# EAGLE design floyd (EAGLE 7.5.0)
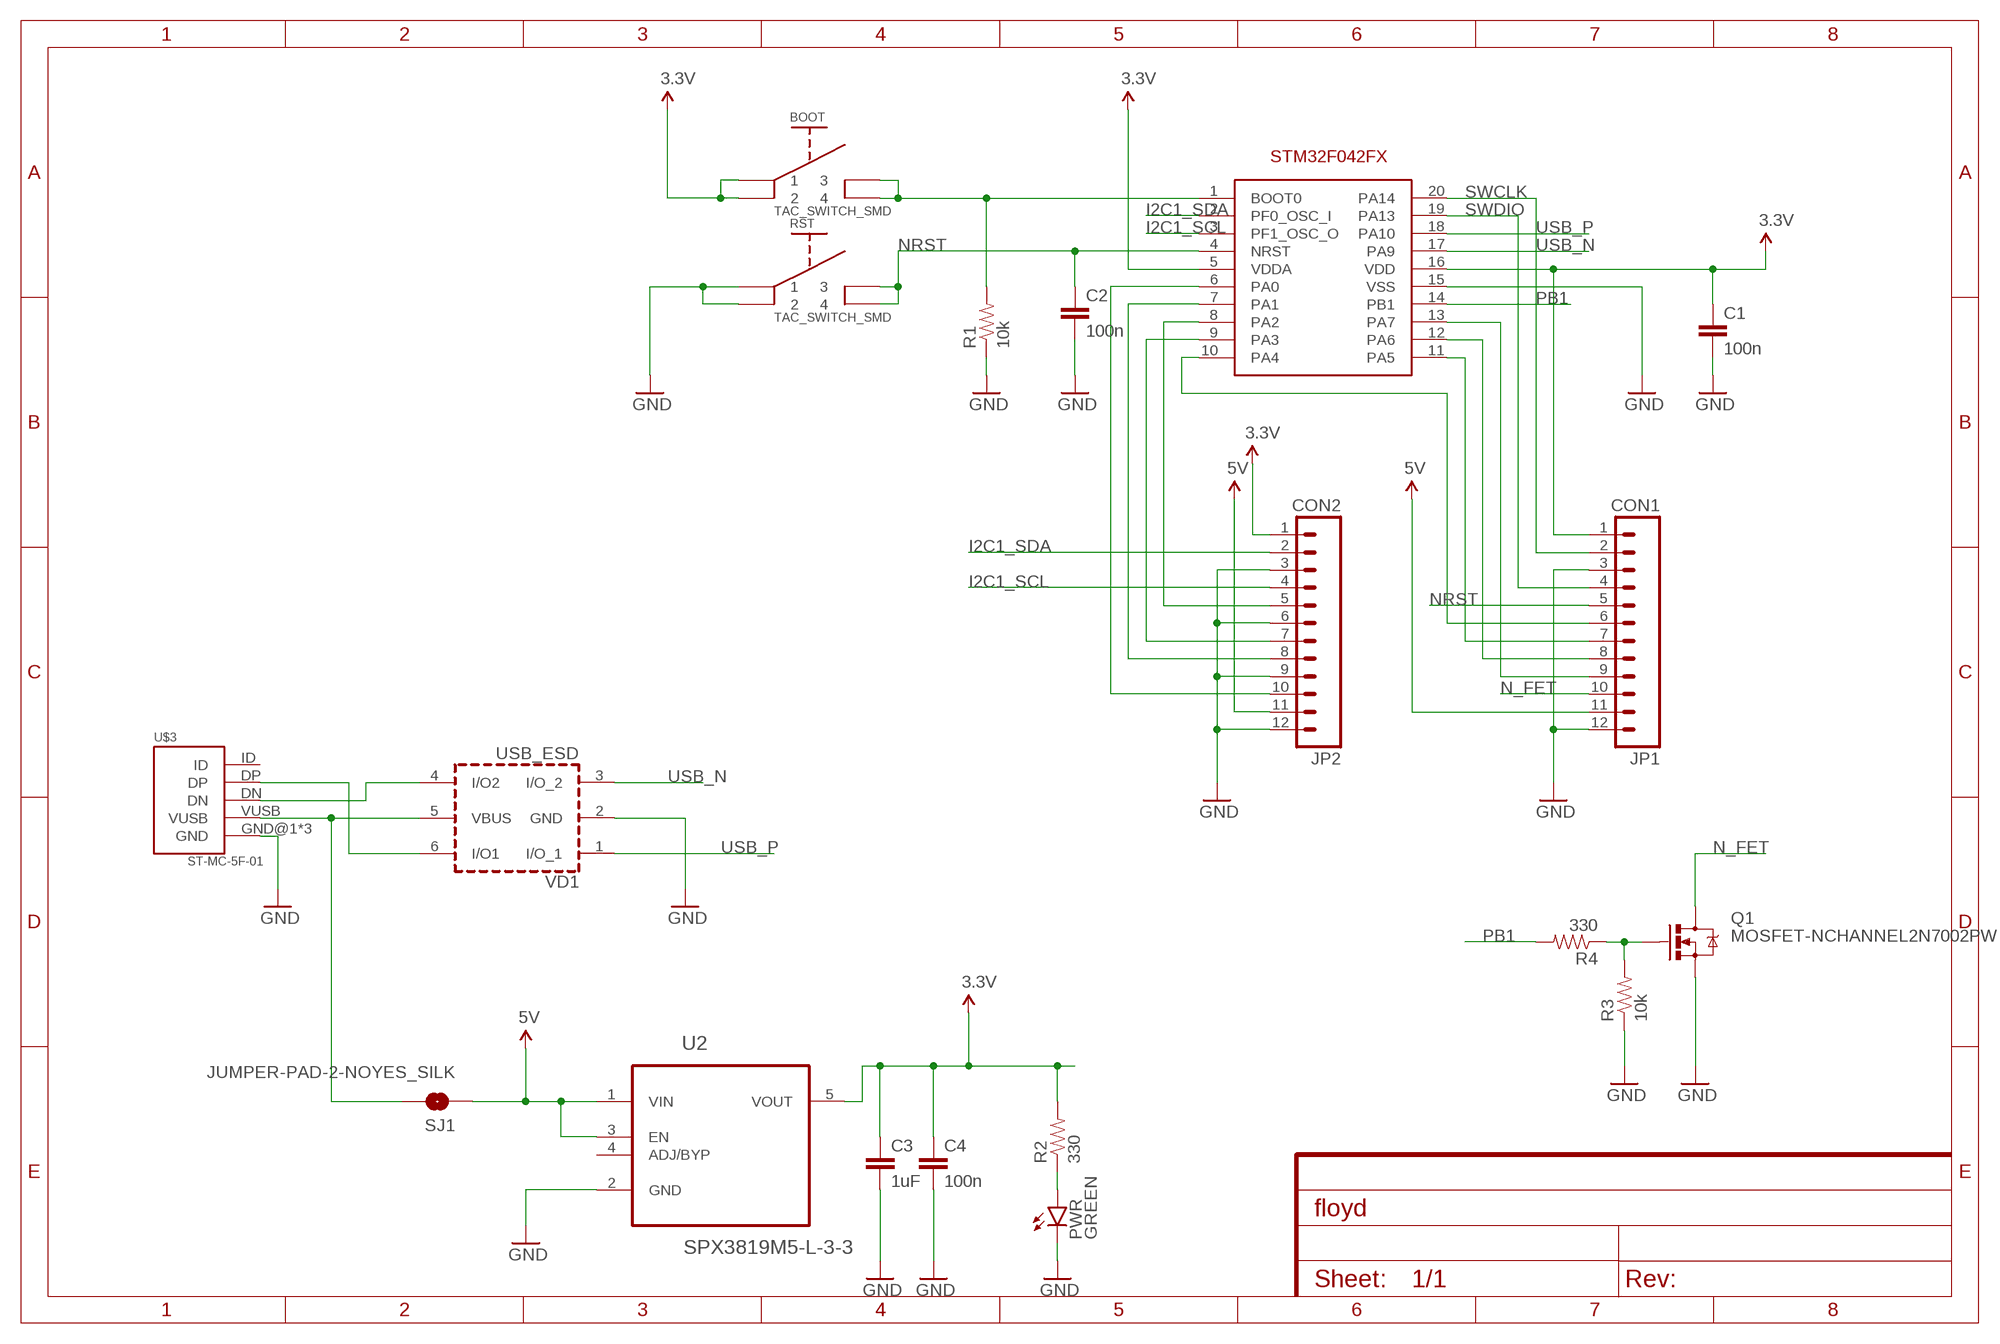
[diagram p0: schematic, sheet 1]

## Parts
BOOT  TS-017A  [TS-017ASMD]
C1  100n  CAP0603-CAP  [0603-CAP]
C2  100n  CAP0603-CAP  [0603-CAP]
C3  1uF  CAP0603-CAP  [0603-CAP]
C4  100n  CAP0603-CAP  [0603-CAP]
JP1  CON1  M12LOCK_LONGPADS  [1X12_LOCK_LONGPADS]
JP2  CON2  M12LOCK_LONGPADS  [1X12_LOCK_LONGPADS]
PWR  GREEN  LED0603  [LED-0603]
Q1  MOSFET-NCHANNEL2N7002PW  [SOT323]
R1  10k  RESISTOR0603-RES  [0603-RES]
R2  330  RESISTOR0603-RES  [0603-RES]
R3  10k  RESISTOR0603-RES  [0603-RES]
R4  330  RESISTOR0603-RES  [0603-RES]
RST  TS-017A  [TS-017ASMD]
SJ1  JUMPER-PAD-2-NOYES_SILK  [PAD-JUMPER-2-NO_YES_SILK]
U1  STM32F042FX  [TSSOP20]
U2  SPX3819M5-L-3-3  [SOT95P280X145-5N]
U$3  ST-MC-5F-01  [ST-MC-5F-01]
VD1  USB_ESD  USBLC6-2SC6  [SOT-23-6L]

## Nets
3.3V: BOOT.P$1 BOOT.P$2 C1.1 C3.1 C4.1 JP1.1 JP2.1 R2.2 U1.5(VDDA) U1.16(VDD) U2.5(VOUT)
5V: JP1.11 JP2.11 SJ1.1 U2.1(VIN) U2.3(EN)
GND: C1.2 C2.2 C3.2 C4.2 JP1.3 JP1.12 JP2.3 JP2.6 JP2.9 JP2.12 PWR.C Q1.2(S) R1.1 R3.1 RST.P$1 RST.P$2 U1.15(VSS) U2.2(GND) U$3.GND@1(GND) U$3.GND@2(GND) U$3.GND@3(GND) VD1.2(GND)
I2C1_SCL: JP2.4 U1.3(PF1_OSC_O)
I2C1_SDA: JP2.2 U1.2(PF0_OSC_I)
N$1: BOOT.P$3 BOOT.P$4 R1.2 U1.1(BOOT0)
N$2: SJ1.2 U$3.VUSB VD1.5(VBUS)
N$3: U$3.DN VD1.4(I/O2)
N$4: U$3.DP VD1.6(I/O1)
N$5: JP1.6 U1.10(PA4)
N$6: JP1.7 U1.11(PA5)
N$7: PWR.A R2.1
N$8: JP1.8 U1.12(PA6)
N$9: JP1.9 U1.13(PA7)
N$10: Q1.1(G) R3.2 R4.1
N$11: JP2.5 U1.8(PA2)
N$12: JP2.7 U1.9(PA3)
N$13: JP2.8 U1.7(PA1)
N$14: JP2.10 U1.6(PA0)
N_FET: JP1.10 Q1.3(D)
NRST: C2.1 JP1.5 RST.P$3 RST.P$4 U1.4(NRST)
PB1: R4.2 U1.14(PB1)
SWCLK: JP1.2 U1.20(PA14)
SWDIO: JP1.4 U1.19(PA13)
USB_N: U1.17(PA9) VD1.3(I/O_2)
USB_P: U1.18(PA10) VD1.1(I/O_1)
Unconnected: U2.4(ADJ/BYP) U$3.ID

## Library data of the parts
BOOT RST = aliexpress-ts-017a:TS-017A
C1-C4 = SparkFun-Passives:CAP: Capacitor Standard 0603 ceramic capacitor, and 0.1" leaded capacitor.
JP1 JP2 = SparkFun-Connectors:M12: Header 12 Standard 12-pin 0.1" header. Use with straight break away headers (SKU : PRT-00116), right angle break away headers (PRT-00553), swiss pins (PRT-00743), machine pins (PRT-00117), and female headers (PRT-00115).
PWR = SparkFun-LED:LED: LEDs Standard schematic elements and footprints for 5mm, 3mm, 1206, and 0603 sized LEDs. 5mm - Spark Fun Electronics SKU : COM-00529 (and others)
Q1 = SparkFun-DiscreteSemi:MOSFET-NCHANNEL: Common NMOSFET Parts MFG P/N Store ID Prod ID FDD8780 TRANS-09984 SI7820DN TRANS-11055 FDS6630A IC-08089 2N7002PW TRANS-11151 FQP30N06L COM-10213 TRANS-10060 BSS123LT1G TRANS-08345 BSS138 TRANS-00830 BS170 2N7000; PROD_ID: TRANS-11151
R1-R4 = SparkFun-Passives:RESISTOR: Resistor Basic schematic elements and footprints for 0603, 1206, and PTH resistors.
SJ1 = SparkFun-Passives:JUMPER-PAD-2-NO
U1 = STM32F042Fx:STM32F042FX: STM32F042Fx microcontroller
U2 = spx319m5-3-3:SPX3819M5-L-3-3: 500mA, LOW-NOISE LDO VOLTAGE REGULATOR; MPN: SPX3819M5-L-3-3; OC_FARNELL: 1831949; OC_NEWARK: 23R9702; PACKAGE: SOT-23-5; SUPPLIER: EXAR
U$3 = st-mc-5f-01:ST-MC-5F-01
VD1 = usblc6:USBLC6-2: VERY LOW CAPACITANCE ESD PROTECTION 2 line Datasheet link <http://www.st.com/web/catalog/sense_power/FM114/CL1137/SC1489/PF93353>

## Board
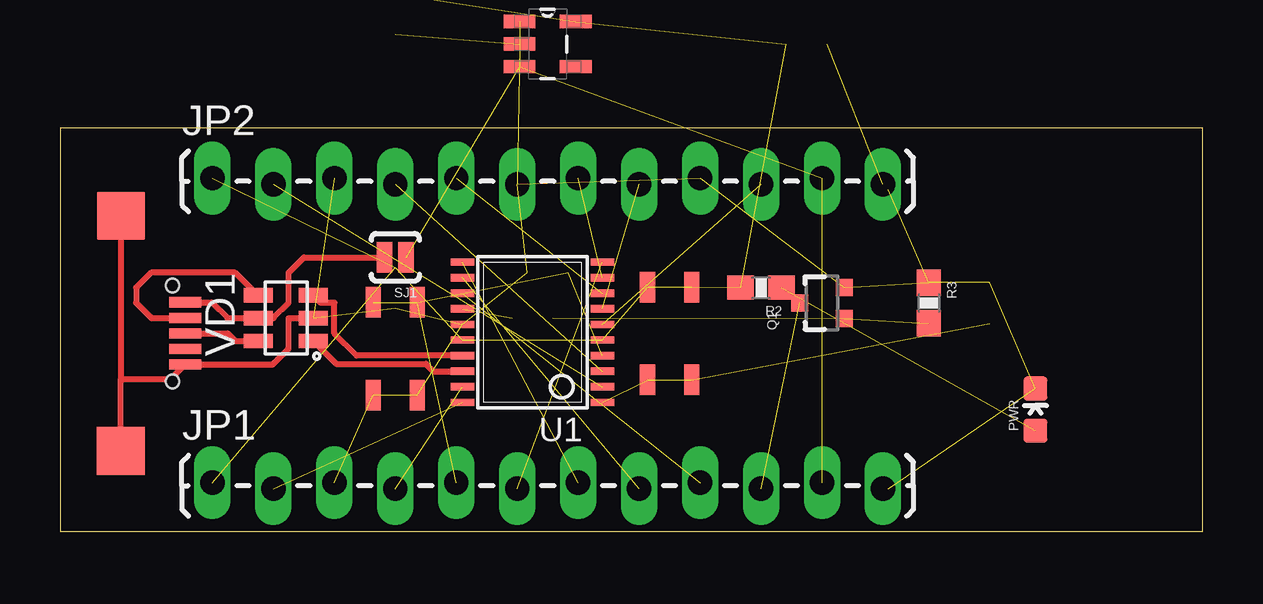
[diagram p1: board, top side]
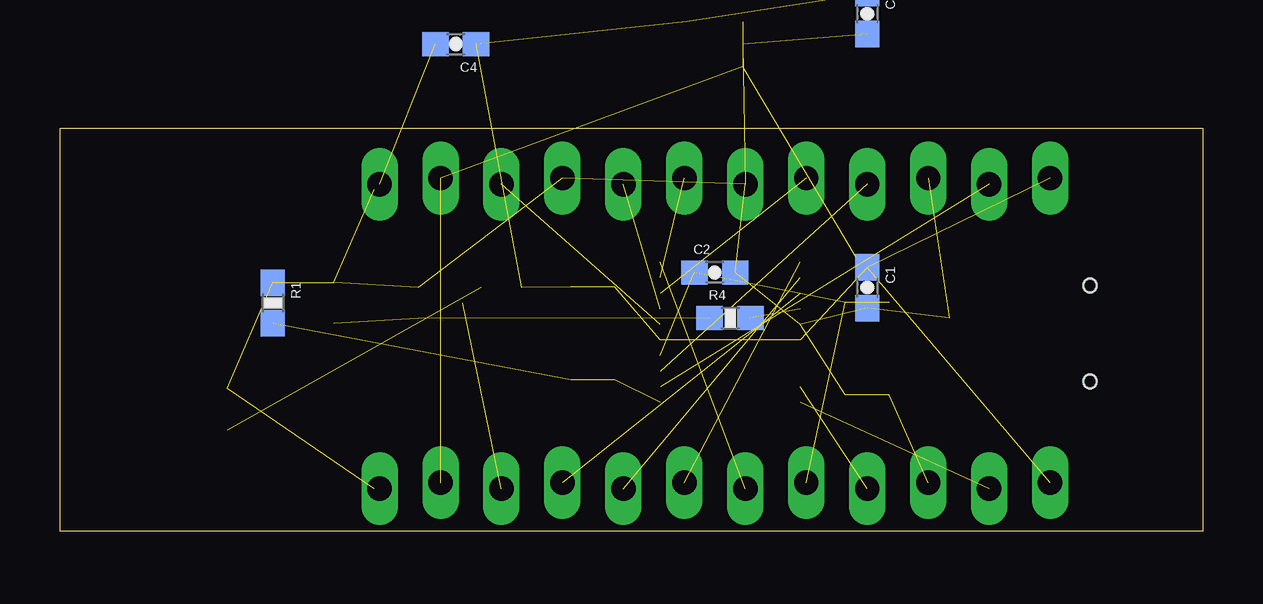
[diagram p2: board, bottom side, seen from below]

Size 47.6 x 16.82 mm. Coordinates in mm from the lower left corner, seen from the top.
Outline: 0,0 47.6,0 47.6,16.82 0,16.82 0,0
Copper layers (1*16): Top 0.035mm / dielectric 1.5mm / Bottom 0.035mm
Design rules "default": minimum track width 10mil, minimum drill 24mil, track to track 8mil, track to pad 8mil, pad to pad 8mil, via to via 8mil, smd to smd 8mil, copper to edge 40mil, drill to drill 8mil, minimum pad ring 10mil, minimum via ring 8mil, stop-mask expansion 4mil, vias tented up to drill 0mil, thermal gap 10mil

### Footprints (pad centres in the part's own frame; a part is rotated, then mirrored left to right if it is on the bottom)
TS-017ASMD = smd 1.27 x 0.635: P$1 -1.935,0.917; P$2 -1.935,-0.917; P$3 1.935,0.917; P$4 1.935,-0.917
0603-CAP = smd 1.1 x 1: 1 -0.85,0; 2 0.85,0
1X12_LOCK_LONGPADS = drill 1.016 long: 1 0,0.127; 2 2.54,-0.127; 3 5.08,0.127; 4 7.62,-0.127; 5 10.16,0.127; 6 12.7,-0.127; 7 15.24,0.127; 8 17.78,-0.127; 9 20.32,0.127; 10 22.86,-0.127; 11 25.4,0.127; 12 27.94,-0.127
LED-0603 = smd 1 x 1: A 0,-0.877; C 0,0.877
SOT323 = smd 0.7 x 0.7: 1 -0.65,-0.925; 2 0.65,-0.925; 3 0,0.925
0603-RES = smd 1.1 x 1: 1 -0.85,0; 2 0.85,0
PAD-JUMPER-2-NO_YES_SILK = smd 0.635 x 1.27: 1 -0.45,0; 2 0.45,0
TSSOP20 = smd 0.305 x 0.991: 1 -2.925,-2.918; 2 -2.275,-2.918; 3 -1.625,-2.918; 4 -0.975,-2.918; 5 -0.325,-2.918; 6 0.325,-2.918; 7 0.975,-2.918; 8 1.625,-2.918; 9 2.275,-2.918; 10 2.925,-2.918; 11 2.925,2.918; 12 2.275,2.918; 13 1.625,2.918; 14 0.975,2.918; 15 0.325,2.918; 16 -0.325,2.918; 17 -0.975,2.918; 18 -1.625,2.918; 19 -2.275,2.918; 20 -2.925,2.918
SOT95P280X145-5N = smd 1.321 x 0.559: 1 -1.168,0.94; 2 -1.168,0; 3 -1.168,-0.94; 4 1.168,-0.94; 5 1.168,0.94
ST-MC-5F-01 = smd 0.4 x 1.35: DN -0.65,2.675; DP 0,2.675; GND@3 1.3,2.675; ID 0.65,2.675; VUSB -1.3,2.675 | smd 2 x 2: GND@1 -4.9,0; GND@2 4.9,0 | hole 0.55: -2,2.15; 2,2.15
SOT-23-6L = smd 0.6 x 1.2: 1 -0.95,-2.3; 2 0,-2.3; 3 0.95,-2.3; 4 0.95,0; 5 0,0; 6 -0.95,0

### Placement (x,y rotation side)
BOOT  25.4,8.26 270 top
C1  13.97,10.16 270 bottom
C2  20.32,10.79 0 bottom
C3  13.97,21.59 270 bottom  (outside the outline)
C4  31.11,20.32 180 bottom  (outside the outline)
JP1  6.35,1.91 0 top
JP2  6.35,14.61 0 top
PWR  40.64,5.08 0 top
Q1  31.75,9.53 90 top
R1  38.73,9.53 270 bottom
R2  29.21,10.16 180 top
R3  36.2,9.53 270 top
R4  19.68,8.89 0 bottom
RST  13.97,7.62 90 top
SJ1  13.97,11.43 180 top
U1  19.68,8.3 90 top
U2  20.32,20.32 0 top
U$3  2.54,8.26 270 top
VD1  8.26,8.89 90 top

### Tracks (layer width: path | path; a pad name or v marks a point on that pad's centre or on a via)
3.3V  (10 unrouted)
5V  (4 unrouted)
GND  (18 unrouted)
  Top 0.254: U$3.GND@2 2.54,6.35 | 2.54,6.35 4.61,6.35 U$3.GND@3 8.86,6.96 9.53,7.62 9.53,8.89 VD1.2 | U$3.GND@1 2.54,6.35
  Bottom 0.406: JP1.12 34.51,1.78 | 34.51,14.26 JP2.12
I2C1_SCL  (1 unrouted)
I2C1_SDA  (1 unrouted)
N$1  (3 unrouted)
N$2
  Top 0.254: U$3.VUSB 6.32,9.55 6.99,8.89 VD1.5 8.89,8.89 9.53,9.53 9.53,10.79 10.16,11.43 SJ1.2
N$3
  Top 0.254: VD1.4 7.3,10.79 3.81,10.79 3.17,10.16 3.17,9.53 3.81,8.89 3.83,8.9 U$3.DN
N$4
  Top 0.254: U$3.DP 6.99,8.26 7.3,7.94 VD1.6
N$5  (1 unrouted)
N$6  (1 unrouted)
N$7  (1 unrouted)
N$8  (1 unrouted)
N$9  (1 unrouted)
N$10  (2 unrouted)
N$11  (1 unrouted)
N$12  (1 unrouted)
N$13  (1 unrouted)
N$14  (1 unrouted)
N_FET  (1 unrouted)
NRST  (4 unrouted)
PB1  (1 unrouted)
SWCLK  (1 unrouted)
SWDIO  (1 unrouted)
USB_N
  Top 0.254: U1.17 12.36,7.33 11.43,8.26 11.43,9.53 10.87,9.53 VD1.3
USB_P
  Top 0.254: VD1.1 11.51,6.99 15.24,6.99 15.54,6.68 U1.18